# EAGLE design PicKit2 - v4550 (EAGLE 7.6.0)
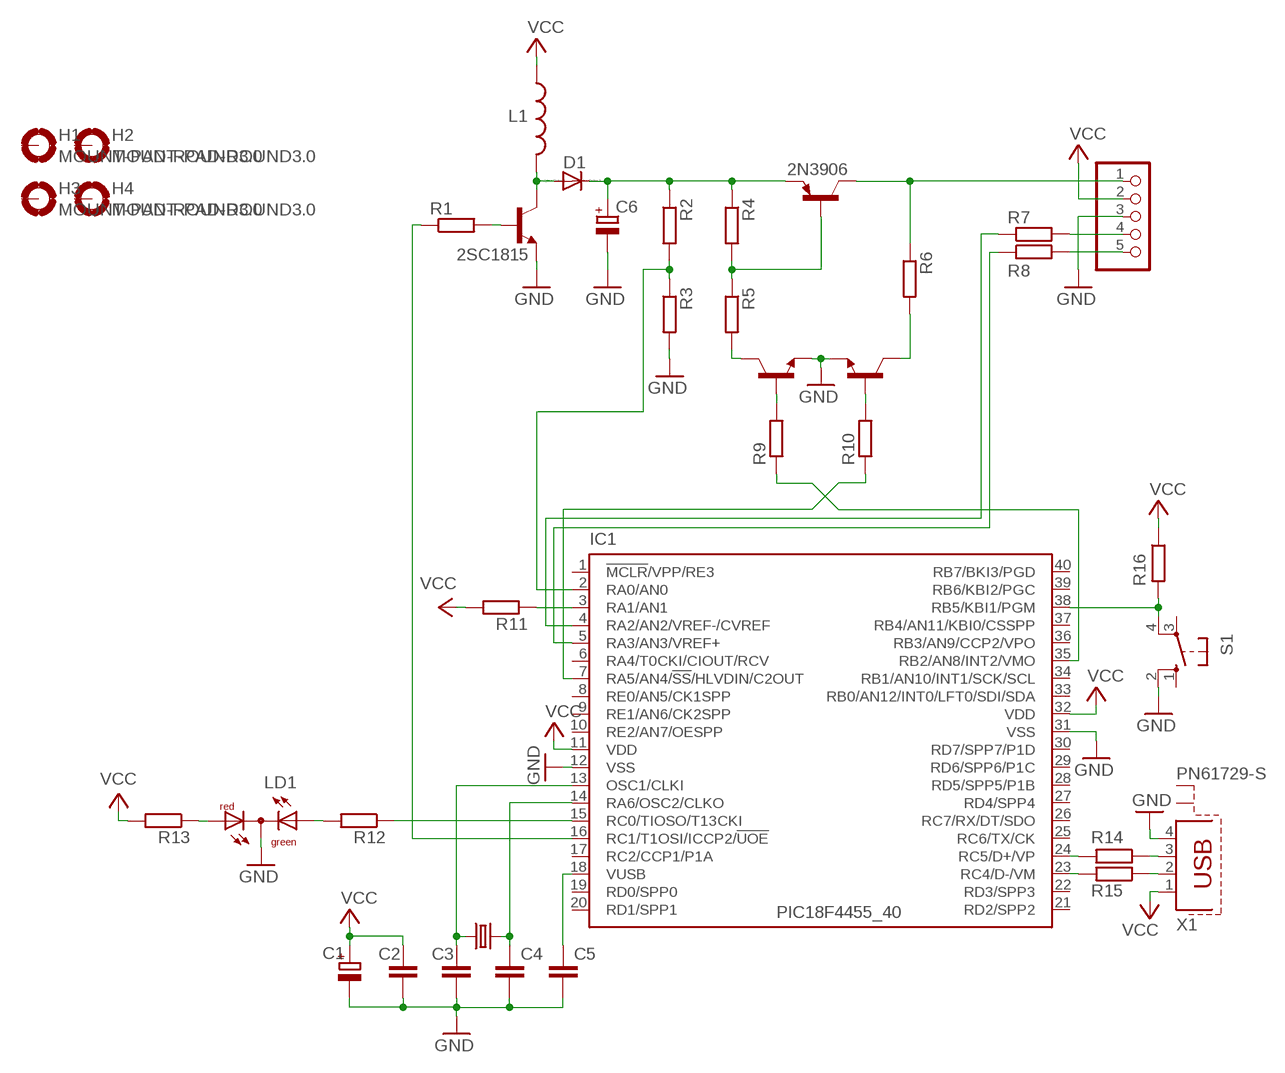
[diagram p0: schematic, sheet 1]

## Parts
C1  CPOL-EUE2,5-6E  [E2,5-6E]
C2  C-EU050-025X075  [C050-025X075]
C3  C-EU050-025X075  [C050-025X075]
C4  C-EU050-025X075  [C050-025X075]
C5  C-EU050-025X075  [C050-025X075]
C6  CPOL-EUE2,5-6E  [E2,5-6E]
D1  1N4148DO35-10  [DO35-10]
H1  MOUNT-PAD-ROUND3.0  [3,0-PAD]
H2  MOUNT-PAD-ROUND3.0  [3,0-PAD]
H3  MOUNT-PAD-ROUND3.0  [3,0-PAD]
H4  MOUNT-PAD-ROUND3.0  [3,0-PAD]
IC1  PIC18F4455_40  [DIL40]
JP1  PINHD-1X5/90  [1X05/90]
L1  L-USIR-2  [IR-2]
LD1  DUOLED-RG-C  [DUOLED-C-5MM]
Q1  2N3906  [TO92]
R1  R-EU_0207/10  [0207/10]
R2  R-EU_0207/10  [0207/10]
R3  R-EU_0207/10  [0207/10]
R4  R-EU_0207/10  [0207/10]
R5  R-EU_0207/10  [0207/10]
R6  R-EU_0207/10  [0207/10]
R7  R-EU_0207/10  [0207/10]
R8  R-EU_0207/10  [0207/10]
R9  R-EU_0207/10  [0207/10]
R10  R-EU_0207/10  [0207/10]
R11  R-EU_0207/10  [0207/10]
R12  R-EU_0207/10  [0207/10]
R13  R-EU_0207/10  [0207/10]
R14  R-EU_0207/10  [0207/10]
R15  R-EU_0207/10  [0207/10]
R16  R-EU_0207/10  [0207/10]
S1  10-XX  [B3F-10XX]
T1  2SC1815  [TO92-ECB]
T2  2SC1815  [TO92-ECB]
T3  2SC1815  [TO92-ECB]
X1  PN61729-S  [PN61729-S]
Y1  CRYSTALHC49S  [HC49/S]

## Nets
GND: C1.- C2.2 C3.2 C4.2 C5.2 C6.- IC1.12(VSS) IC1.31(VSS) JP1.3 LD1.C R3.2 S1.2(S1) T1.E T2.E T3.E X1.4
N$1: R15.1 X1.2
N$2: R14.1 X1.3
N$3: IC1.23(RC4/D-/VM) R15.2
N$4: IC1.24(RC5/D+/VP) R14.2
N$5: D1.A L1.2 T1.C
N$6: IC1.2(RA0/AN0) R2.2 R3.1
N$7: C6.+ D1.C Q1.3(E) R2.1 R4.1
N$8: Q1.2(B) R4.2 R5.1
N$9: R1.2 T1.B
N$10: R6.2 T3.C
N$11: JP1.1 Q1.1(C) R6.1
N$12: R9.2 T2.B
N$13: R5.2 T2.C
N$14: R10.2 T3.B
N$15: IC1.7(RA5/AN4/!SS!/HLVDIN/C2OUT) R10.1
N$16: IC1.16(RC1/T1OSI/ICCP2/!UOE) R1.1
N$17: IC1.35(RB2/AN8/INT2/VMO) R9.1
N$18: JP1.5 R8.2
N$19: JP1.4 R7.2
N$20: IC1.4(RA2/AN2/VREF-/CVREF) R7.1
N$21: IC1.5(RA3/AN3/VREF+) R8.1
N$22: C3.1 IC1.13(OSC1/CLKI) Y1.1
N$23: C4.1 IC1.14(RA6/OSC2/CLKO) Y1.2
N$24: C5.1 IC1.18(VUSB)
N$25: IC1.38(RB5/KBI1/PGM) R16.2 S1.4(P1)
N$26: IC1.3(RA1/AN1) R11.1
N$27: LD1.AR R13.1
N$28: LD1.AX(AG) R12.2
N$29: IC1.15(RC0/TIOSO/T13CKI) R12.1
VCC: C1.+ C2.1 IC1.11(VDD) IC1.32(VDD) JP1.2 L1.1 R11.2 R13.2 R16.1 X1.1
Unconnected: H1.B3,0(MOUNT) H2.B3,0(MOUNT) H3.B3,0(MOUNT) H4.B3,0(MOUNT) IC1.1(!MCLR!/VPP/RE3) IC1.6(RA4/T0CKI/CIOUT/RCV) IC1.8(RE0/AN5/CK1SPP) IC1.9(RE1/AN6/CK2SPP) IC1.10(RE2/AN7/OESPP) IC1.17(RC2/CCP1/P1A) IC1.19(RD0/SPP0) IC1.20(RD1/SPP1) IC1.21(RD2/SPP2) IC1.22(RD3/SPP3) IC1.25(RC6/TX/CK) IC1.26(RC7/RX/DT/SDO) IC1.27(RD4/SPP4) IC1.28(RD5/SPP5/P1B) IC1.29(RD6/SPP6/P1C) IC1.30(RD7/SPP7/P1D) IC1.33(RB0/AN12/INT0/LFT0/SDI/SDA) IC1.34(RB1/AN10/INT1/SCK/SCL) IC1.36(RB3/AN9/CCP2/VPO) IC1.37(RB4/AN11/KBI0/CSSPP) IC1.39(RB6/KBI2/PGC) IC1.40(RB7/BKI3/PGD) S1.1(S) S1.3(P) X1.S1 X1.S2

## Library data of the parts
C1 C6 = rcl:CPOL-EU: POLARIZED CAPACITOR, European symbol
C2-C5 = rcl:C-EU: CAPACITOR, European symbol
D1 = diode:1N4148: DIODE high speed (Philips)
H1-H4 = holes:MOUNT-PAD-ROUND: MOUNTING PAD, round
IC1 = microchip:PIC18F4*_40: USB Microcontrollers with nanoWatt Technology High-Performance, Enhanced Flash, 28/40/44-Pin, Source: http://ww1.microchip.com/downloads/en/devicedoc/39632c.pdf; MF: MICROCHIP; MPN: PIC18F4455-I/P; OC_FARNELL: 9321314; OC_NEWARK: 05K2028
JP1 = pinhead:PINHD-1X5: PIN HEADER
L1 = rcl:L-US: INDUCTOR, American symbol
LD1 = led:DUOLED-RG-C: DUO LED 2 colors (red/green), 5 mm, round, common Cathode www.ligitek.com or other producers.
Q1 = transistor-pnp:2N3906: PNP Transistor
R1-R16 = rcl:R-EU_: RESISTOR, European symbol
S1 = switch-omron:10-XX: OMRON SWITCH; MPN: B3F-1000; OC_FARNELL: 176432; OC_NEWARK: 36M3542
T1-T3 = transistor:2SC1815: NPN EPITAXIAL TRANSISTOR Source: TOSHIBA .. 2SC1815 1.pdf
X1 = con-berg:PN61729-S: BERG USB connector; OC_FARNELL: unknown; OC_NEWARK: unknown
Y1 = crystal:CRYSTAL: CRYSTAL; OC_FARNELL: 1667008; OC_NEWARK: unknown

## Board
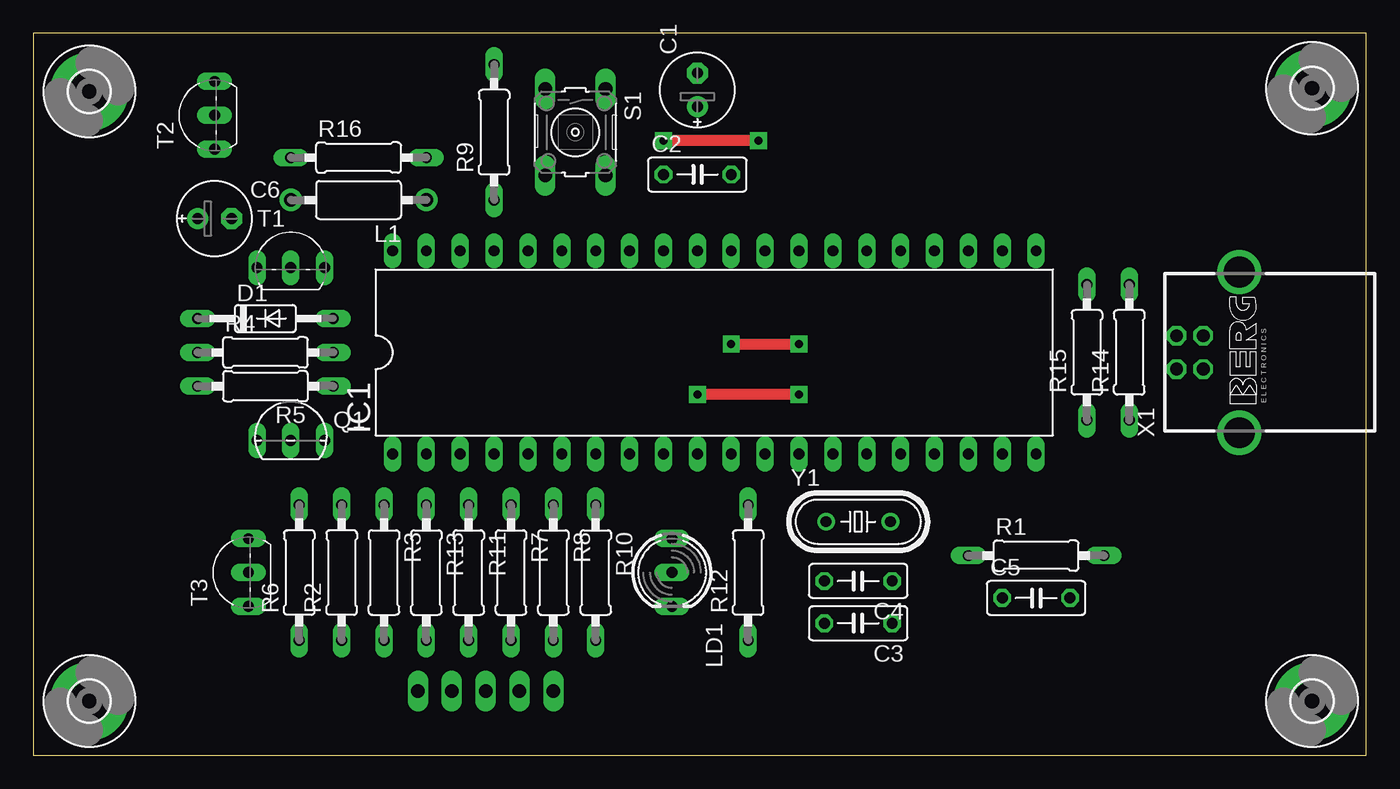
[diagram p1: board, top side]
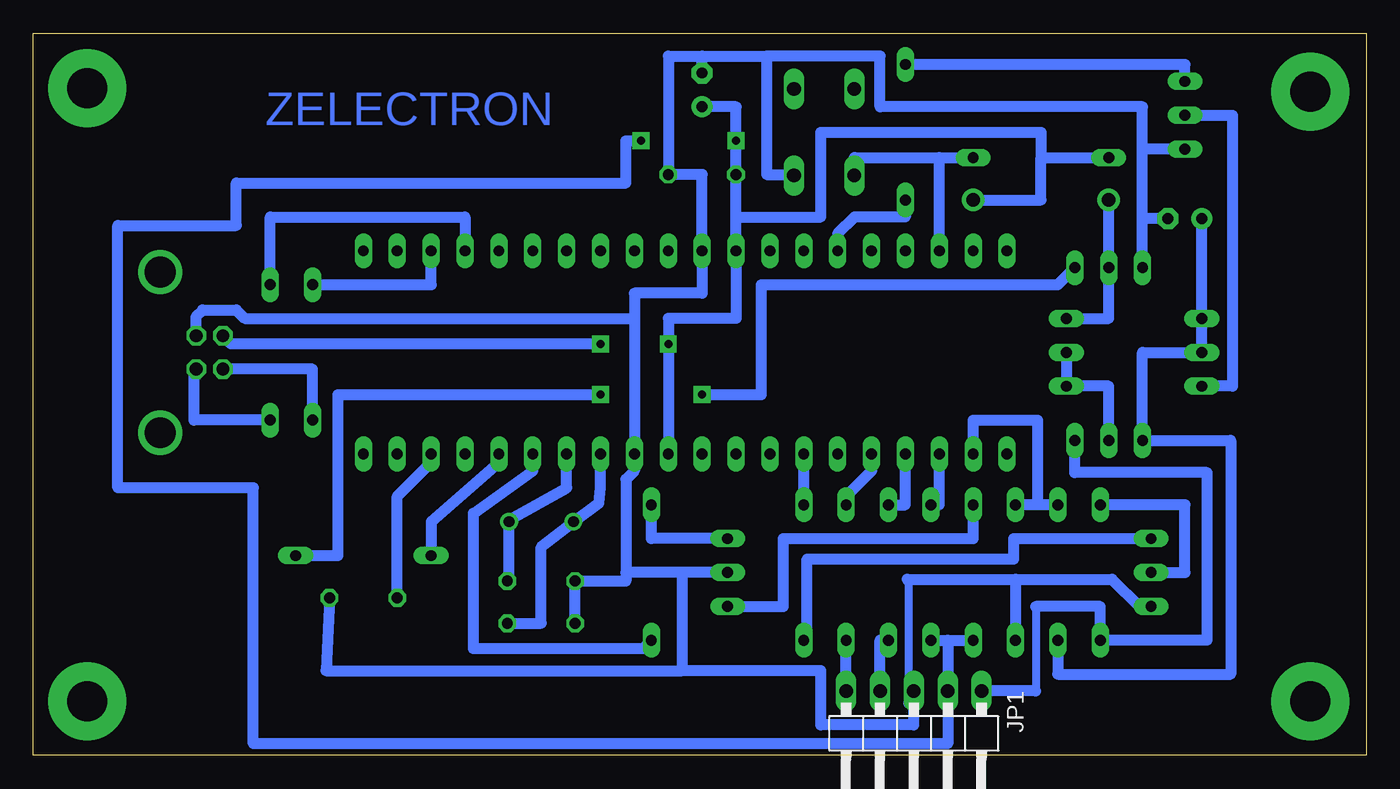
[diagram p2: board, bottom side, seen from below]

Size 99.93 x 54.15 mm. Coordinates in mm from the lower left corner, seen from the top.
Outline: 0,0 99.93,0 99.93,54.15 0,54.15 0,0
Copper layers (1*16): Top 0.035mm / dielectric 1.5mm / Bottom 0.035mm
Design rules "default": minimum track width 10mil, minimum drill 24mil, track to track 8mil, track to pad 8mil, pad to pad 8mil, via to via 8mil, smd to smd 8mil, copper to edge 40mil, drill to drill 8mil, minimum pad ring 10mil, minimum via ring 8mil, stop-mask expansion 4mil, vias tented up to drill 0mil, thermal gap 10mil

### Footprints (pad centres in the part's own frame; a part is rotated, then mirrored left to right if it is on the bottom)
E2,5-6E = drill 0.813 pad 1.575: + -1.27,0 | drill 0.813 pad 1.575 octagon: - 1.27,0
C050-025X075 = drill 0.813 octagon: 1 -2.54,0; 2 2.54,0
DO35-10 = drill 0.813 long: A 5.08,0; C -5.08,0
3,0-PAD = drill 3 pad 5.842: B3,0 0,0
DIL40 = drill 0.813 long: 1 -24.13,-7.62; 2 -21.59,-7.62; 3 -19.05,-7.62; 4 -16.51,-7.62; 5 -13.97,-7.62; 6 -11.43,-7.62; 7 -8.89,-7.62; 8 -6.35,-7.62; 9 -3.81,-7.62; 10 -1.27,-7.62; 11 1.27,-7.62; 12 3.81,-7.62; 13 6.35,-7.62; 14 8.89,-7.62; 15 11.43,-7.62; 16 13.97,-7.62; 17 16.51,-7.62; 18 19.05,-7.62; 19 21.59,-7.62; 20 24.13,-7.62; 21 24.13,7.62; 22 21.59,7.62; 23 19.05,7.62; 24 16.51,7.62; 25 13.97,7.62; 26 11.43,7.62; 27 8.89,7.62; 28 6.35,7.62; 29 3.81,7.62; 30 1.27,7.62; 31 -1.27,7.62; 32 -3.81,7.62; 33 -6.35,7.62; 34 -8.89,7.62; 35 -11.43,7.62; 36 -13.97,7.62; 37 -16.51,7.62; 38 -19.05,7.62; 39 -21.59,7.62; 40 -24.13,7.62
1X05/90 = drill 1.016 long: 1 -5.08,-3.81; 2 -2.54,-3.81; 3 0,-3.81; 4 2.54,-3.81; 5 5.08,-3.81
IR-2 = drill 1 pad 1.676: 1 -5.08,0; 2 5.08,0
DUOLED-C-5MM = drill 0.813 long: AR 2.54,0; AX -2.54,0; C 0,0
TO92 = drill 0.813 long: 1 2.54,-0.254; 2 0,-0.254; 3 -2.54,-0.254
0207/10 = drill 0.813 long: 1 -5.08,0; 2 5.08,0
B3F-10XX = drill 1.016 long: 1 -3.251,2.261; 2 3.251,2.261; 3 -3.251,-2.261; 4 3.251,-2.261
TO92-ECB = drill 0.813 long: B 2.54,0; C 0,0; E -2.54,0
PN61729-S = drill 0.95 octagon: 1 1.25,4.71; 2 -1.25,4.71; 3 -1.25,2.71; 4 1.25,2.71 | drill 2.3 pad 2.9: S1 -6.02,0; S2 6.02,0
HC49/S = drill 0.813: 1 -2.413,0; 2 2.413,0

### Placement (x,y rotation side)
C1  49.78,49.91 90 top
C2  49.78,43.56 0 top
C3  61.85,9.91 180 top
C4  61.85,13.08 180 top
C5  75.18,11.81 0 top
C6  13.59,40.26 0 top
D1  17.4,32.77 0 top
H1  95.89,4.06 0 top
H2  4.19,4.06 0 top
H3  95.89,50.04 0 top
H4  4.19,49.78 0 top
IC1  51.05,30.23 0 top
JP1  33.91,1.02 180 bottom
L1  24.38,41.66 180 top
LD1  47.88,13.72 270 top
Q1  19.3,23.88 0 top
R1  75.18,14.99 0 top
R2  23.11,13.72 90 top
R3  26.29,13.72 270 top
R4  17.4,30.23 0 top
R5  17.4,27.69 180 top
R6  19.94,13.72 90 top
R7  35.81,13.72 270 top
R8  38.99,13.72 270 top
R9  34.54,46.74 90 top
R10  42.16,13.72 270 top
R11  32.64,13.72 270 top
R12  53.59,13.72 90 top
R13  29.46,13.72 270 top
R14  82.17,30.23 90 top
R15  78.99,30.23 90 top
R16  24.38,44.83 0 top
S1  40.64,46.74 270 top
T1  19.3,36.58 0 top
T2  13.59,48.01 90 top
T3  16.13,13.72 90 top
X1  90.42,30.23 90 top
Y1  61.85,17.53 0 top

### Tracks (layer width: path | path; a pad name or v marks a point on that pad's centre or on a via)
GND
  Bottom 0.61: 34.29,3.94 34.29,13.08
  Bottom 0.813: C3.2 C4.2 55.5,13.08 55.5,13.72 | C5.2 77.98,6.35 51.31,6.35 | 49.78,52.45 52.32,52.45 C2.2 49.78,43.56 IC1.31 49.78,34.67 54.86,34.67 54.86,32.77 | 49.78,52.45 44.96,52.45 | 44.96,52.45 44.96,43.56 42.98,43.56 S1.2 | T1.E 16.76,40.39 | 16.76,40.39 16.76,45.47 | 26.29,13.21 34.42,13.21 34.29,13.08 | 26.29,13.21 R3.2 | 34.29,3.94 JP1.3 33.91,2.29 40.89,2.29 40.89,6.35 51.31,6.35 | C6.- 16.64,40.26 16.76,40.39 | 26.29,13.21 19.05,13.21 17.02,11.18 T3.E | T2.E 16.76,45.47 | 16.76,45.47 16.76,48.64 36.45,48.64 36.45,52.45 44.96,52.45 | C1.- 49.78,52.45 | 54.86,32.77 IC1.12 54.86,21.34 55.5,20.7 55.5,13.72 | X1.4 87.71,32.94 87.25,33.4 84.71,33.4 84.07,32.77 54.86,32.77 | 51.31,13.72 55.5,13.72 | LD1.C 51.31,13.72 | 51.31,13.72 51.31,6.35
N$1
  Bottom 0.813: R15.1 78.99,28.98 X1.2
N$2
  Bottom 0.813: R14.1 87.88,25.15 87.88,28.98 X1.3
N$3
  Bottom 0.813: R15.2 70.1,35.31 IC1.23
N$4
  Bottom 0.813: R14.2 82.17,40.39 67.56,40.39 IC1.24
N$5
  Bottom 0.813: L1.2 T1.C 19.3,32.77 D1.A
N$6
  Bottom 0.813: R2.2 24.64,18.8 | 24.64,18.8 R3.1 | IC1.2 29.46,25.15 24.64,25.15 24.64,18.8
N$7
  Bottom 0.813: R4.1 D1.C | R4.1 C6.+ | R4.1 16.76,30.23 Q1.3 10.16,23.62 10.16,6.1 23.11,6.1 R2.1
N$8
  Bottom 0.813: R4.2 R5.1 19.3,27.69 Q1.2
N$9  (via drill 0.6 pad 1.27)
  Top 0.813: v57.4,27.05 v49.78,27.05
  Bottom 0.813: R1.2 77.09,14.99 77.09,27.05 v57.4,27.05 | v49.78,27.05 45.34,27.05 45.34,35.31 23.11,35.31 T1.B
N$10
  Bottom 0.813: T3.C 13.59,13.72 13.59,18.8 R6.2
N$11
  Bottom 0.61: 24.77,11.18 24.77,4.83
  Bottom 0.813: Q1.1 21.84,21.21 11.94,21.21 11.94,8.64 R6.1 19.94,11.18 24.77,11.18 | 24.77,4.83 JP1.1
N$12
  Bottom 0.813: T2.B 13.59,51.82 R9.2
N$13
  Bottom 0.813: T2.C 10.03,48.01 10.03,27.69 R5.2
N$14
  Bottom 0.813: R10.2 41.91,8.64 41.91,14.73 26.42,14.73 26.42,16.26 T3.B
N$15
  Bottom 0.813: R10.1 IC1.7
N$16
  Bottom 0.813: IC1.16 65.02,21.97 70.1,17.53 R1.1
N$17
  Bottom 0.813: R9.1 34.54,40.39 38.35,40.39 39.62,39.12 IC1.35
N$18
  Bottom 0.813: JP1.5 R8.2
N$19
  Bottom 0.813: JP1.4 36.45,8.64 R7.2
N$20
  Bottom 0.813: R7.1 34.54,18.8 IC1.4
N$21
  Bottom 0.813: R8.1 38.99,19.43 37.08,21.34 IC1.5
N$22
  Bottom 0.813: C3.1 61.85,9.91 61.85,15.62 Y1.1 57.53,18.92 57.4,20.07 IC1.13
N$23
  Bottom 0.813: C4.1 64.26,13.08 Y1.2 64.26,17.65 59.94,20.07 IC1.14
N$24
  Bottom 0.813: C5.1 72.64,19.43 70.1,21.97 IC1.18
N$25
  Bottom 0.813: IC1.38 32,44.83 | 32,44.83 R16.2 | S1.4 38.38,44.81 38.35,44.83 32,44.83
N$26
  Bottom 0.813: R11.1 32,18.8 IC1.3
N$27
  Bottom 0.813: R13.1 29.46,16.26 43.69,16.26 43.69,11.18 LD1.AR
N$28
  Bottom 0.813: LD1.AX 53.59,16.26 R12.2
N$29
  Bottom 0.813: R12.1 54.23,8 66.93,8 66.93,18.16 62.48,21.34 IC1.15
VCC  (via drill 0.6 pad 1.27)
  Top 0.813: v52.32,30.86 v57.4,30.86 | v54.36,46.1 v47.24,46.1
  Bottom 0.813: 47.24,40.39 IC1.32 47.24,32.77 52.32,32.77 v52.32,30.86 IC1.11 | 47.24,40.39 40.89,40.39 40.89,46.74 24.38,46.74 24.38,44.83 | 47.24,40.39 C2.1 v47.24,46.1 47.24,48.64 C1.+ | L1.1 24.38,41.66 24.38,44.83 | 24.38,44.83 R16.1 | v57.4,30.86 85.1,30.86 X1.1 | 31.37,8.64 R13.2 | R11.2 31.37,8.64 | 31.37,8.64 JP1.2 31.37,0.89 83.44,0.89 83.44,20.07 93.6,20.07 93.6,39.75 84.71,39.75 84.71,42.93 55.5,42.93 55.5,46.1 v54.36,46.1

### Text on the board
Bottom: ZELECTRON